# Altium schematic sheet HIVE_BOARD_TOP.SchDoc
size Tabloid; SheetNumber: 2; SheetTotal: 3; Sheet_Name: Top; Size: 11x17
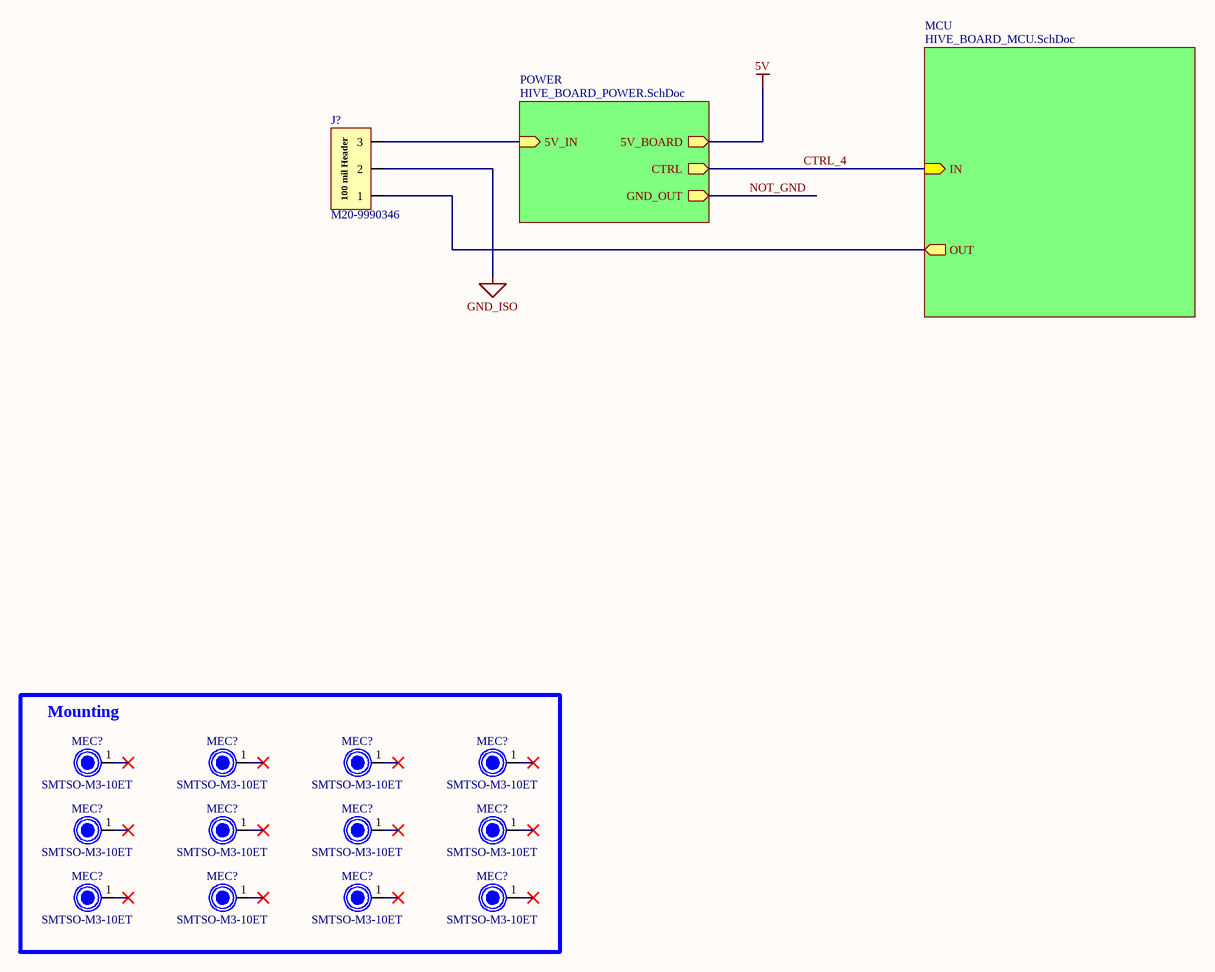
[diagram p0: HIVE_BOARD_TOP.SchDoc]

## Parts
(Parts that share a designator on the sheet are numbered #1, #2 ... from top to bottom, then left to right.)
J?  M20-9990346  [CON_HDR_M20-9990346]
MEC?#1  SMTSO-M3-10ET  [MEC_PEM_SMTSO-M3-10ET]
MEC?#2  SMTSO-M3-10ET  [MEC_PEM_SMTSO-M3-10ET]
MEC?#3  SMTSO-M3-10ET  [MEC_PEM_SMTSO-M3-10ET]
MEC?#4  SMTSO-M3-10ET  [MEC_PEM_SMTSO-M3-10ET]
MEC?#5  SMTSO-M3-10ET  [MEC_PEM_SMTSO-M3-10ET]
MEC?#6  SMTSO-M3-10ET  [MEC_PEM_SMTSO-M3-10ET]
MEC?#7  SMTSO-M3-10ET  [MEC_PEM_SMTSO-M3-10ET]
MEC?#8  SMTSO-M3-10ET  [MEC_PEM_SMTSO-M3-10ET]
MEC?#9  SMTSO-M3-10ET  [MEC_PEM_SMTSO-M3-10ET]
MEC?#10  SMTSO-M3-10ET  [MEC_PEM_SMTSO-M3-10ET]
MEC?#11  SMTSO-M3-10ET  [MEC_PEM_SMTSO-M3-10ET]
MEC?#12  SMTSO-M3-10ET  [MEC_PEM_SMTSO-M3-10ET]

## Blocks framed on the sheet
Mounting: MEC?#1-MEC?#12

## Sub-sheets
MCU = HIVE_BOARD_MCU.SchDoc: OUT (out), IN (in)
POWER = HIVE_BOARD_POWER.SchDoc: 5V_BOARD (out), 5V_IN (in), CTRL (out), GND_OUT (out)

## Nets
5V: sheet POWER/5V_BOARD
GND_ISO: J?.2
CTRL_4: sheet MCU/IN, sheet POWER/CTRL
NOT_GND: sheet POWER/GND_OUT
NetJ?_1: J?.1 ; sheet MCU/OUT
NetJ?_3: J?.3 ; sheet POWER/5V_IN

Not connected (* = marked no-connect by the designer): MEC?#1 1*; MEC?#2 1*; MEC?#3 1*; MEC?#4 1*; MEC?#5 1*; MEC?#6 1*; MEC?#7 1*; MEC?#8 1*; MEC?#9 1*; MEC?#10 1*; MEC?#11 1*; MEC?#12 1*

## Notes on the sheet
- Sheet Name
- Project Title
- Global Project
- Revision
- Size
- Date
- Group
- Sheet
- of
- Filename
- Designers
- (in symbol CON_HDR_M20-9990346) 100 mil Header

## Library data of the parts
J? = CON_HDR_M20-9990346: CON - HDR 100 MIL 3 POS - TH; Manufacturer #1: Harwin Inc.; Current Rating: 3A per contact; Magnetic Material: No; GRAMS Lib Spec: 2.8; Assembly Type: TH; Manufacturer #2: Harwin Inc.; Part Number #1: M20-9990346; Part Number #2: M20-9994046; Package: TH; Polarized: No; Power Max: -; Value: -; Voltage Rating: -; Temperature: -40°C ~ 105°C; HelpURL: https://cdn.harwin.com/pdfs/M20-999.pdf; CreatedBy/Date: L-P Gauthier/2018/05/11; Supplier 1: Digi-Key; Supplier Part Number 1: 952-2264-ND; Tolerance: -; VerifiedBy: Caroline Paulin - 2 oct 2018
MEC?#1-MEC?#12 = MEC_PEM_SMTSO-M3-10ET: MEC- PEM SMD THREADED SPACER M3 10mm - SMD; Manufacturer #1: PENN ENGINEERING; GRAMS Lib Spec: 2.8; Magnetic Material: Unknown; Polarized: NO; Value: M3; Tolerance: -; Voltage Rating: -; Current Rating: *; Power Max: -; HelpURL: https://catalog.pemnet.com/item/all-categories/nt-nuts-and-spacers-standoffs-br-type-smtso-metric/smtso-m3-10et?plpver=1018; CreatedBy/Date: Raphel Bouchard/07-05-2019; VerifiedBy: Jonathan Bouchard 2019-05-27; Temperature: -; Package: SMD; Manufacturer #2: *; Note: *; Assembly Type: SMD; Part Number #2: *; Part Number #1: SMTSO-M3-10ET; Supplier 1: Hi-Tech Fasteners; Supplier Part Number 1: SMTSO-M3-10ET